# Altium project diplomka_hiearchical.PrjPcb (part 3 of 4)
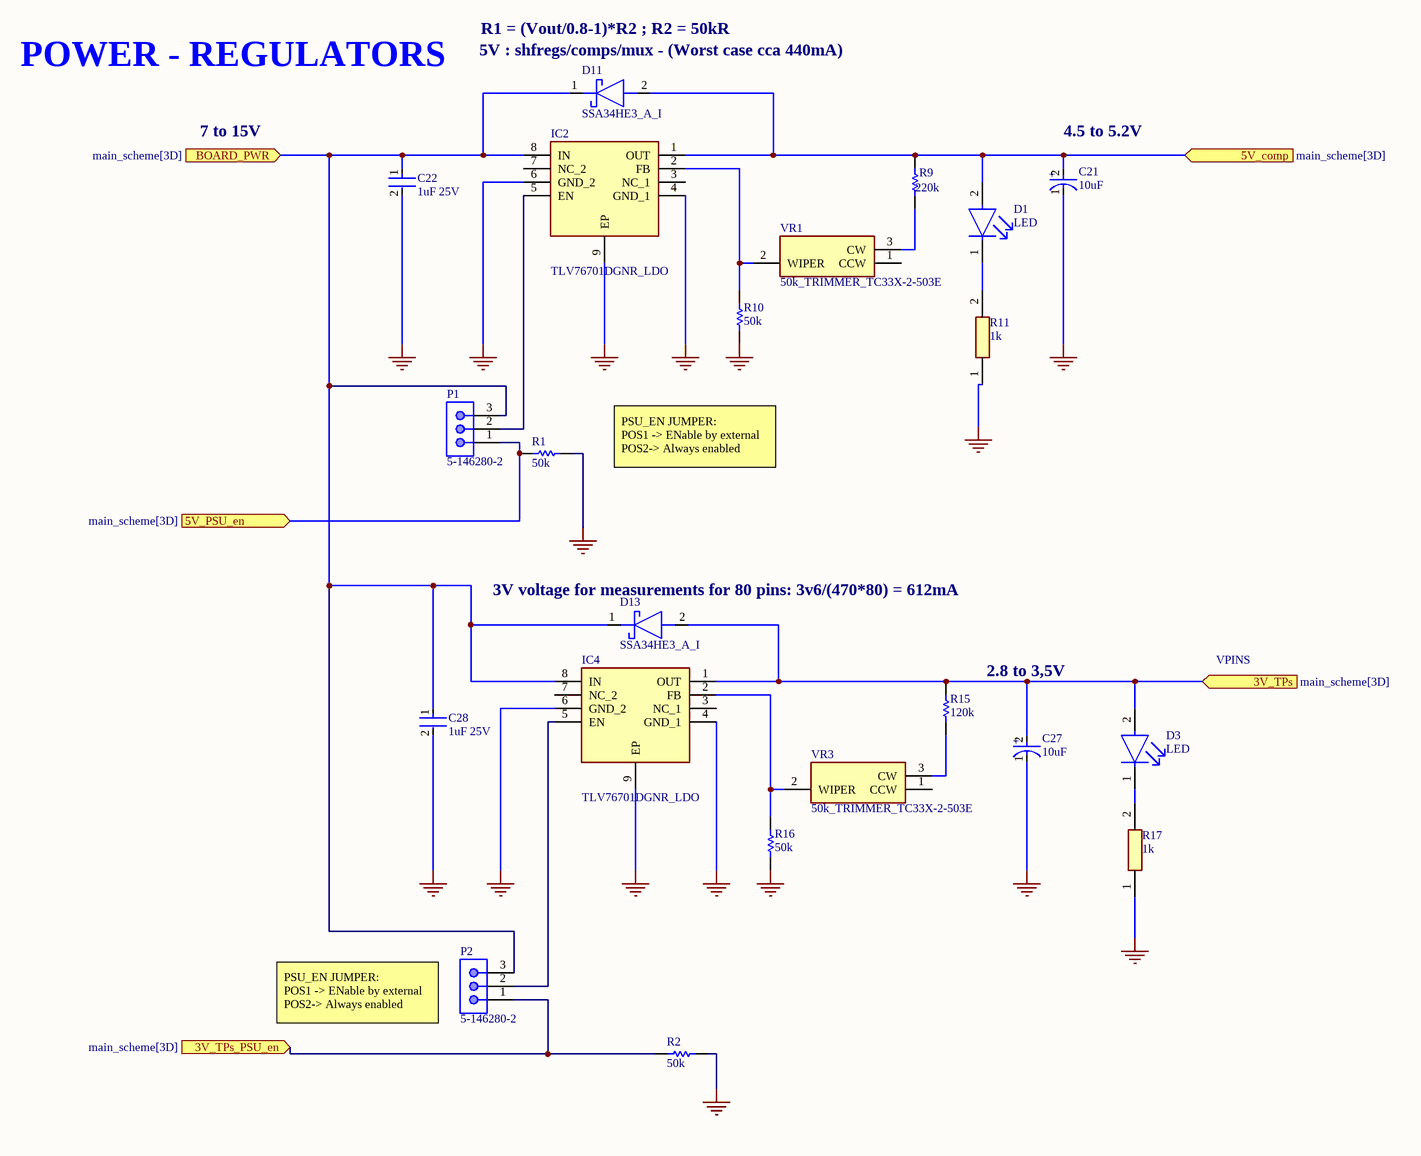
[diagram p5: POWER.SchDoc]
## Nets that join several sheets
BOARD_PWR: main_scheme (6 pins), POWER (8 pins)
GND: main_scheme (7 pins), U_ALL_channels/8pins1 (6 pins), U_ALL_channels/8pins1/dTP (U_ALL_channels_8pins1_dTP_IC1#1.4 U_ALL_channels_8pins1_dTP_Q3#1.2 U_ALL_channels_8pins1_dTP_Q4#1.2), U_ALL_channels/8pins1/dTP (U_ALL_channels_8pins1_dTP_IC1#2.4 U_ALL_channels_8pins1_dTP_Q3#2.2 U_ALL_channels_8pins1_dTP_Q4#2.2), U_ALL_channels/8pins1/dTP (U_ALL_channels_8pins1_dTP_IC1#3.4 U_ALL_channels_8pins1_dTP_Q3#3.2 U_ALL_channels_8pins1_dTP_Q4#3.2), U_ALL_channels/8pins1/dTP (U_ALL_channels_8pins1_dTP_IC1#4.4 U_ALL_channels_8pins1_dTP_Q3#4.2 U_ALL_channels_8pins1_dTP_Q4#4.2), U_ALL_channels/8pins2 (6 pins), U_ALL_channels/8pins2/dTP (U_ALL_channels_8pins2_dTP_IC1#1.4 U_ALL_channels_8pins2_dTP_Q3#1.2 U_ALL_channels_8pins2_dTP_Q4#1.2), U_ALL_channels/8pins2/dTP (U_ALL_channels_8pins2_dTP_IC1#2.4 U_ALL_channels_8pins2_dTP_Q3#2.2 U_ALL_channels_8pins2_dTP_Q4#2.2), U_ALL_channels/8pins2/dTP (U_ALL_channels_8pins2_dTP_IC1#3.4 U_ALL_channels_8pins2_dTP_Q3#3.2 U_ALL_channels_8pins2_dTP_Q4#3.2), U_ALL_channels/8pins2/dTP (U_ALL_channels_8pins2_dTP_IC1#4.4 U_ALL_channels_8pins2_dTP_Q3#4.2 U_ALL_channels_8pins2_dTP_Q4#4.2), U_ALL_channels/8pins3 (6 pins), U_ALL_channels/8pins3/dTP (U_ALL_channels_8pins3_dTP_IC1#1.4 U_ALL_channels_8pins3_dTP_Q3#1.2 U_ALL_channels_8pins3_dTP_Q4#1.2), U_ALL_channels/8pins3/dTP (U_ALL_channels_8pins3_dTP_IC1#2.4 U_ALL_channels_8pins3_dTP_Q3#2.2 U_ALL_channels_8pins3_dTP_Q4#2.2), U_ALL_channels/8pins3/dTP (U_ALL_channels_8pins3_dTP_IC1#3.4 U_ALL_channels_8pins3_dTP_Q3#3.2 U_ALL_channels_8pins3_dTP_Q4#3.2), U_ALL_channels/8pins3/dTP (U_ALL_channels_8pins3_dTP_IC1#4.4 U_ALL_channels_8pins3_dTP_Q3#4.2 U_ALL_channels_8pins3_dTP_Q4#4.2), U_ALL_channels/8pins4 (6 pins), U_ALL_channels/8pins4/dTP (U_ALL_channels_8pins4_dTP_IC1#1.4 U_ALL_channels_8pins4_dTP_Q3#1.2 U_ALL_channels_8pins4_dTP_Q4#1.2), U_ALL_channels/8pins4/dTP (U_ALL_channels_8pins4_dTP_IC1#2.4 U_ALL_channels_8pins4_dTP_Q3#2.2 U_ALL_channels_8pins4_dTP_Q4#2.2), U_ALL_channels/8pins4/dTP (U_ALL_channels_8pins4_dTP_IC1#3.4 U_ALL_channels_8pins4_dTP_Q3#3.2 U_ALL_channels_8pins4_dTP_Q4#3.2), U_ALL_channels/8pins4/dTP (U_ALL_channels_8pins4_dTP_IC1#4.4 U_ALL_channels_8pins4_dTP_Q3#4.2 U_ALL_channels_8pins4_dTP_Q4#4.2), U_ALL_channels/8pins5 (6 pins), U_ALL_channels/8pins5/dTP (U_ALL_channels_8pins5_dTP_IC1#1.4 U_ALL_channels_8pins5_dTP_Q3#1.2 U_ALL_channels_8pins5_dTP_Q4#1.2), U_ALL_channels/8pins5/dTP (U_ALL_channels_8pins5_dTP_IC1#2.4 U_ALL_channels_8pins5_dTP_Q3#2.2 U_ALL_channels_8pins5_dTP_Q4#2.2), U_ALL_channels/8pins5/dTP (U_ALL_channels_8pins5_dTP_IC1#3.4 U_ALL_channels_8pins5_dTP_Q3#3.2 U_ALL_channels_8pins5_dTP_Q4#3.2), U_ALL_channels/8pins5/dTP (U_ALL_channels_8pins5_dTP_IC1#4.4 U_ALL_channels_8pins5_dTP_Q3#4.2 U_ALL_channels_8pins5_dTP_Q4#4.2), U_ALL_channels/8pins6 (6 pins), U_ALL_channels/8pins6/dTP (U_ALL_channels_8pins6_dTP_IC1#1.4 U_ALL_channels_8pins6_dTP_Q3#1.2 U_ALL_channels_8pins6_dTP_Q4#1.2), U_ALL_channels/8pins6/dTP (U_ALL_channels_8pins6_dTP_IC1#2.4 U_ALL_channels_8pins6_dTP_Q3#2.2 U_ALL_channels_8pins6_dTP_Q4#2.2), U_ALL_channels/8pins6/dTP (U_ALL_channels_8pins6_dTP_IC1#3.4 U_ALL_channels_8pins6_dTP_Q3#3.2 U_ALL_channels_8pins6_dTP_Q4#3.2), U_ALL_channels/8pins6/dTP (U_ALL_channels_8pins6_dTP_IC1#4.4 U_ALL_channels_8pins6_dTP_Q3#4.2 U_ALL_channels_8pins6_dTP_Q4#4.2), U_ALL_channels/8pins7 (6 pins), U_ALL_channels/8pins7/dTP (U_ALL_channels_8pins7_dTP_IC1#1.4 U_ALL_channels_8pins7_dTP_Q3#1.2 U_ALL_channels_8pins7_dTP_Q4#1.2), U_ALL_channels/8pins7/dTP (U_ALL_channels_8pins7_dTP_IC1#2.4 U_ALL_channels_8pins7_dTP_Q3#2.2 U_ALL_channels_8pins7_dTP_Q4#2.2), U_ALL_channels/8pins7/dTP (U_ALL_channels_8pins7_dTP_IC1#3.4 U_ALL_channels_8pins7_dTP_Q3#3.2 U_ALL_channels_8pins7_dTP_Q4#3.2), U_ALL_channels/8pins7/dTP (U_ALL_channels_8pins7_dTP_IC1#4.4 U_ALL_channels_8pins7_dTP_Q3#4.2 U_ALL_channels_8pins7_dTP_Q4#4.2), U_ALL_channels/8pins8 (6 pins), U_ALL_channels/8pins8/dTP (U_ALL_channels_8pins8_dTP_IC1#1.4 U_ALL_channels_8pins8_dTP_Q3#1.2 U_ALL_channels_8pins8_dTP_Q4#1.2), U_ALL_channels/8pins8/dTP (U_ALL_channels_8pins8_dTP_IC1#2.4 U_ALL_channels_8pins8_dTP_Q3#2.2 U_ALL_channels_8pins8_dTP_Q4#2.2), U_ALL_channels/8pins8/dTP (U_ALL_channels_8pins8_dTP_IC1#3.4 U_ALL_channels_8pins8_dTP_Q3#3.2 U_ALL_channels_8pins8_dTP_Q4#3.2), U_ALL_channels/8pins8/dTP (U_ALL_channels_8pins8_dTP_IC1#4.4 U_ALL_channels_8pins8_dTP_Q3#4.2 U_ALL_channels_8pins8_dTP_Q4#4.2), U_ALL_channels/8pins9 (6 pins), U_ALL_channels/8pins9/dTP (U_ALL_channels_8pins9_dTP_IC1#1.4 U_ALL_channels_8pins9_dTP_Q3#1.2 U_ALL_channels_8pins9_dTP_Q4#1.2), U_ALL_channels/8pins9/dTP (U_ALL_channels_8pins9_dTP_IC1#2.4 U_ALL_channels_8pins9_dTP_Q3#2.2 U_ALL_channels_8pins9_dTP_Q4#2.2), U_ALL_channels/8pins9/dTP (U_ALL_channels_8pins9_dTP_IC1#3.4 U_ALL_channels_8pins9_dTP_Q3#3.2 U_ALL_channels_8pins9_dTP_Q4#3.2), U_ALL_channels/8pins9/dTP (U_ALL_channels_8pins9_dTP_IC1#4.4 U_ALL_channels_8pins9_dTP_Q3#4.2 U_ALL_channels_8pins9_dTP_Q4#4.2), U_ALL_channels/8pins10 (6 pins), U_ALL_channels/8pins10/dTP (U_ALL_channels_8pins10_dTP_IC1#1.4 U_ALL_channels_8pins10_dTP_Q3#1.2 U_ALL_channels_8pins10_dTP_Q4#1.2), U_ALL_channels/8pins10/dTP (U_ALL_channels_8pins10_dTP_IC1#2.4 U_ALL_channels_8pins10_dTP_Q3#2.2 U_ALL_channels_8pins10_dTP_Q4#2.2), U_ALL_channels/8pins10/dTP (U_ALL_channels_8pins10_dTP_IC1#3.4 U_ALL_channels_8pins10_dTP_Q3#3.2 U_ALL_channels_8pins10_dTP_Q4#3.2), U_ALL_channels/8pins10/dTP (U_ALL_channels_8pins10_dTP_IC1#4.4 U_ALL_channels_8pins10_dTP_Q3#4.2 U_ALL_channels_8pins10_dTP_Q4#4.2), POWER (16 pins)
PWR_MCU: main_scheme (J1.A28 J1.B28 J1.C28 J22.28), U_ALL_channels/8pins1/dTP (U_ALL_channels_8pins1_dTP_R5#1.1 U_ALL_channels_8pins1_dTP_R6#1.1), U_ALL_channels/8pins1/dTP (U_ALL_channels_8pins1_dTP_R5#2.1 U_ALL_channels_8pins1_dTP_R6#2.1), U_ALL_channels/8pins1/dTP (U_ALL_channels_8pins1_dTP_R5#3.1 U_ALL_channels_8pins1_dTP_R6#3.1), U_ALL_channels/8pins1/dTP (U_ALL_channels_8pins1_dTP_R5#4.1 U_ALL_channels_8pins1_dTP_R6#4.1), U_ALL_channels/8pins2/dTP (U_ALL_channels_8pins2_dTP_R5#1.1 U_ALL_channels_8pins2_dTP_R6#1.1), U_ALL_channels/8pins2/dTP (U_ALL_channels_8pins2_dTP_R5#2.1 U_ALL_channels_8pins2_dTP_R6#2.1), U_ALL_channels/8pins2/dTP (U_ALL_channels_8pins2_dTP_R5#3.1 U_ALL_channels_8pins2_dTP_R6#3.1), U_ALL_channels/8pins2/dTP (U_ALL_channels_8pins2_dTP_R5#4.1 U_ALL_channels_8pins2_dTP_R6#4.1), U_ALL_channels/8pins3/dTP (U_ALL_channels_8pins3_dTP_R5#1.1 U_ALL_channels_8pins3_dTP_R6#1.1), U_ALL_channels/8pins3/dTP (U_ALL_channels_8pins3_dTP_R5#2.1 U_ALL_channels_8pins3_dTP_R6#2.1), U_ALL_channels/8pins3/dTP (U_ALL_channels_8pins3_dTP_R5#3.1 U_ALL_channels_8pins3_dTP_R6#3.1), U_ALL_channels/8pins3/dTP (U_ALL_channels_8pins3_dTP_R5#4.1 U_ALL_channels_8pins3_dTP_R6#4.1), U_ALL_channels/8pins4/dTP (U_ALL_channels_8pins4_dTP_R5#1.1 U_ALL_channels_8pins4_dTP_R6#1.1), U_ALL_channels/8pins4/dTP (U_ALL_channels_8pins4_dTP_R5#2.1 U_ALL_channels_8pins4_dTP_R6#2.1), U_ALL_channels/8pins4/dTP (U_ALL_channels_8pins4_dTP_R5#3.1 U_ALL_channels_8pins4_dTP_R6#3.1), U_ALL_channels/8pins4/dTP (U_ALL_channels_8pins4_dTP_R5#4.1 U_ALL_channels_8pins4_dTP_R6#4.1), U_ALL_channels/8pins5/dTP (U_ALL_channels_8pins5_dTP_R5#1.1 U_ALL_channels_8pins5_dTP_R6#1.1), U_ALL_channels/8pins5/dTP (U_ALL_channels_8pins5_dTP_R5#2.1 U_ALL_channels_8pins5_dTP_R6#2.1), U_ALL_channels/8pins5/dTP (U_ALL_channels_8pins5_dTP_R5#3.1 U_ALL_channels_8pins5_dTP_R6#3.1), U_ALL_channels/8pins5/dTP (U_ALL_channels_8pins5_dTP_R5#4.1 U_ALL_channels_8pins5_dTP_R6#4.1), U_ALL_channels/8pins6/dTP (U_ALL_channels_8pins6_dTP_R5#1.1 U_ALL_channels_8pins6_dTP_R6#1.1), U_ALL_channels/8pins6/dTP (U_ALL_channels_8pins6_dTP_R5#2.1 U_ALL_channels_8pins6_dTP_R6#2.1), U_ALL_channels/8pins6/dTP (U_ALL_channels_8pins6_dTP_R5#3.1 U_ALL_channels_8pins6_dTP_R6#3.1), U_ALL_channels/8pins6/dTP (U_ALL_channels_8pins6_dTP_R5#4.1 U_ALL_channels_8pins6_dTP_R6#4.1), U_ALL_channels/8pins7/dTP (U_ALL_channels_8pins7_dTP_R5#1.1 U_ALL_channels_8pins7_dTP_R6#1.1), U_ALL_channels/8pins7/dTP (U_ALL_channels_8pins7_dTP_R5#2.1 U_ALL_channels_8pins7_dTP_R6#2.1), U_ALL_channels/8pins7/dTP (U_ALL_channels_8pins7_dTP_R5#3.1 U_ALL_channels_8pins7_dTP_R6#3.1), U_ALL_channels/8pins7/dTP (U_ALL_channels_8pins7_dTP_R5#4.1 U_ALL_channels_8pins7_dTP_R6#4.1), U_ALL_channels/8pins8/dTP (U_ALL_channels_8pins8_dTP_R5#1.1 U_ALL_channels_8pins8_dTP_R6#1.1), U_ALL_channels/8pins8/dTP (U_ALL_channels_8pins8_dTP_R5#2.1 U_ALL_channels_8pins8_dTP_R6#2.1), U_ALL_channels/8pins8/dTP (U_ALL_channels_8pins8_dTP_R5#3.1 U_ALL_channels_8pins8_dTP_R6#3.1), U_ALL_channels/8pins8/dTP (U_ALL_channels_8pins8_dTP_R5#4.1 U_ALL_channels_8pins8_dTP_R6#4.1), U_ALL_channels/8pins9/dTP (U_ALL_channels_8pins9_dTP_R5#1.1 U_ALL_channels_8pins9_dTP_R6#1.1), U_ALL_channels/8pins9/dTP (U_ALL_channels_8pins9_dTP_R5#2.1 U_ALL_channels_8pins9_dTP_R6#2.1), U_ALL_channels/8pins9/dTP (U_ALL_channels_8pins9_dTP_R5#3.1 U_ALL_channels_8pins9_dTP_R6#3.1), U_ALL_channels/8pins9/dTP (U_ALL_channels_8pins9_dTP_R5#4.1 U_ALL_channels_8pins9_dTP_R6#4.1), U_ALL_channels/8pins10/dTP (U_ALL_channels_8pins10_dTP_R5#1.1 U_ALL_channels_8pins10_dTP_R6#1.1), U_ALL_channels/8pins10/dTP (U_ALL_channels_8pins10_dTP_R5#2.1 U_ALL_channels_8pins10_dTP_R6#2.1), U_ALL_channels/8pins10/dTP (U_ALL_channels_8pins10_dTP_R5#3.1 U_ALL_channels_8pins10_dTP_R6#3.1), U_ALL_channels/8pins10/dTP (U_ALL_channels_8pins10_dTP_R5#4.1 U_ALL_channels_8pins10_dTP_R6#4.1)
Vpins: main_scheme (J1.A30 J1.B30 J1.C30 J22.30), U_ALL_channels/8pins1/dTP (U_ALL_channels_8pins1_dTP_Q1#1.2 U_ALL_channels_8pins1_dTP_Q2#1.2), U_ALL_channels/8pins1/dTP (U_ALL_channels_8pins1_dTP_Q1#2.2 U_ALL_channels_8pins1_dTP_Q2#2.2), U_ALL_channels/8pins1/dTP (U_ALL_channels_8pins1_dTP_Q1#3.2 U_ALL_channels_8pins1_dTP_Q2#3.2), U_ALL_channels/8pins1/dTP (U_ALL_channels_8pins1_dTP_Q1#4.2 U_ALL_channels_8pins1_dTP_Q2#4.2), U_ALL_channels/8pins2/dTP (U_ALL_channels_8pins2_dTP_Q1#1.2 U_ALL_channels_8pins2_dTP_Q2#1.2), U_ALL_channels/8pins2/dTP (U_ALL_channels_8pins2_dTP_Q1#2.2 U_ALL_channels_8pins2_dTP_Q2#2.2), U_ALL_channels/8pins2/dTP (U_ALL_channels_8pins2_dTP_Q1#3.2 U_ALL_channels_8pins2_dTP_Q2#3.2), U_ALL_channels/8pins2/dTP (U_ALL_channels_8pins2_dTP_Q1#4.2 U_ALL_channels_8pins2_dTP_Q2#4.2), U_ALL_channels/8pins3/dTP (U_ALL_channels_8pins3_dTP_Q1#1.2 U_ALL_channels_8pins3_dTP_Q2#1.2), U_ALL_channels/8pins3/dTP (U_ALL_channels_8pins3_dTP_Q1#2.2 U_ALL_channels_8pins3_dTP_Q2#2.2), U_ALL_channels/8pins3/dTP (U_ALL_channels_8pins3_dTP_Q1#3.2 U_ALL_channels_8pins3_dTP_Q2#3.2), U_ALL_channels/8pins3/dTP (U_ALL_channels_8pins3_dTP_Q1#4.2 U_ALL_channels_8pins3_dTP_Q2#4.2), U_ALL_channels/8pins4/dTP (U_ALL_channels_8pins4_dTP_Q1#1.2 U_ALL_channels_8pins4_dTP_Q2#1.2), U_ALL_channels/8pins4/dTP (U_ALL_channels_8pins4_dTP_Q1#2.2 U_ALL_channels_8pins4_dTP_Q2#2.2), U_ALL_channels/8pins4/dTP (U_ALL_channels_8pins4_dTP_Q1#3.2 U_ALL_channels_8pins4_dTP_Q2#3.2), U_ALL_channels/8pins4/dTP (U_ALL_channels_8pins4_dTP_Q1#4.2 U_ALL_channels_8pins4_dTP_Q2#4.2), U_ALL_channels/8pins5/dTP (U_ALL_channels_8pins5_dTP_Q1#1.2 U_ALL_channels_8pins5_dTP_Q2#1.2), U_ALL_channels/8pins5/dTP (U_ALL_channels_8pins5_dTP_Q1#2.2 U_ALL_channels_8pins5_dTP_Q2#2.2), U_ALL_channels/8pins5/dTP (U_ALL_channels_8pins5_dTP_Q1#3.2 U_ALL_channels_8pins5_dTP_Q2#3.2), U_ALL_channels/8pins5/dTP (U_ALL_channels_8pins5_dTP_Q1#4.2 U_ALL_channels_8pins5_dTP_Q2#4.2), U_ALL_channels/8pins6/dTP (U_ALL_channels_8pins6_dTP_Q1#1.2 U_ALL_channels_8pins6_dTP_Q2#1.2), U_ALL_channels/8pins6/dTP (U_ALL_channels_8pins6_dTP_Q1#2.2 U_ALL_channels_8pins6_dTP_Q2#2.2), U_ALL_channels/8pins6/dTP (U_ALL_channels_8pins6_dTP_Q1#3.2 U_ALL_channels_8pins6_dTP_Q2#3.2), U_ALL_channels/8pins6/dTP (U_ALL_channels_8pins6_dTP_Q1#4.2 U_ALL_channels_8pins6_dTP_Q2#4.2), U_ALL_channels/8pins7/dTP (U_ALL_channels_8pins7_dTP_Q1#1.2 U_ALL_channels_8pins7_dTP_Q2#1.2), U_ALL_channels/8pins7/dTP (U_ALL_channels_8pins7_dTP_Q1#2.2 U_ALL_channels_8pins7_dTP_Q2#2.2), U_ALL_channels/8pins7/dTP (U_ALL_channels_8pins7_dTP_Q1#3.2 U_ALL_channels_8pins7_dTP_Q2#3.2), U_ALL_channels/8pins7/dTP (U_ALL_channels_8pins7_dTP_Q1#4.2 U_ALL_channels_8pins7_dTP_Q2#4.2), U_ALL_channels/8pins8/dTP (U_ALL_channels_8pins8_dTP_Q1#1.2 U_ALL_channels_8pins8_dTP_Q2#1.2), U_ALL_channels/8pins8/dTP (U_ALL_channels_8pins8_dTP_Q1#2.2 U_ALL_channels_8pins8_dTP_Q2#2.2), U_ALL_channels/8pins8/dTP (U_ALL_channels_8pins8_dTP_Q1#3.2 U_ALL_channels_8pins8_dTP_Q2#3.2), U_ALL_channels/8pins8/dTP (U_ALL_channels_8pins8_dTP_Q1#4.2 U_ALL_channels_8pins8_dTP_Q2#4.2), U_ALL_channels/8pins9/dTP (U_ALL_channels_8pins9_dTP_Q1#1.2 U_ALL_channels_8pins9_dTP_Q2#1.2), U_ALL_channels/8pins9/dTP (U_ALL_channels_8pins9_dTP_Q1#2.2 U_ALL_channels_8pins9_dTP_Q2#2.2), U_ALL_channels/8pins9/dTP (U_ALL_channels_8pins9_dTP_Q1#3.2 U_ALL_channels_8pins9_dTP_Q2#3.2), U_ALL_channels/8pins9/dTP (U_ALL_channels_8pins9_dTP_Q1#4.2 U_ALL_channels_8pins9_dTP_Q2#4.2), U_ALL_channels/8pins10/dTP (U_ALL_channels_8pins10_dTP_Q1#1.2 U_ALL_channels_8pins10_dTP_Q2#1.2), U_ALL_channels/8pins10/dTP (U_ALL_channels_8pins10_dTP_Q1#2.2 U_ALL_channels_8pins10_dTP_Q2#2.2), U_ALL_channels/8pins10/dTP (U_ALL_channels_8pins10_dTP_Q1#3.2 U_ALL_channels_8pins10_dTP_Q2#3.2), U_ALL_channels/8pins10/dTP (U_ALL_channels_8pins10_dTP_Q1#4.2 U_ALL_channels_8pins10_dTP_Q2#4.2), POWER (5 pins)
Vref: main_scheme (J1.C27 J22.32), U_ALL_channels/8pins1/dTP (U_ALL_channels_8pins1_dTP_IC1#1.2 U_ALL_channels_8pins1_dTP_IC1#1.6), U_ALL_channels/8pins1/dTP (U_ALL_channels_8pins1_dTP_IC1#2.2 U_ALL_channels_8pins1_dTP_IC1#2.6), U_ALL_channels/8pins1/dTP (U_ALL_channels_8pins1_dTP_IC1#3.2 U_ALL_channels_8pins1_dTP_IC1#3.6), U_ALL_channels/8pins1/dTP (U_ALL_channels_8pins1_dTP_IC1#4.2 U_ALL_channels_8pins1_dTP_IC1#4.6), U_ALL_channels/8pins2/dTP (U_ALL_channels_8pins2_dTP_IC1#1.2 U_ALL_channels_8pins2_dTP_IC1#1.6), U_ALL_channels/8pins2/dTP (U_ALL_channels_8pins2_dTP_IC1#2.2 U_ALL_channels_8pins2_dTP_IC1#2.6), U_ALL_channels/8pins2/dTP (U_ALL_channels_8pins2_dTP_IC1#3.2 U_ALL_channels_8pins2_dTP_IC1#3.6), U_ALL_channels/8pins2/dTP (U_ALL_channels_8pins2_dTP_IC1#4.2 U_ALL_channels_8pins2_dTP_IC1#4.6), U_ALL_channels/8pins3/dTP (U_ALL_channels_8pins3_dTP_IC1#1.2 U_ALL_channels_8pins3_dTP_IC1#1.6), U_ALL_channels/8pins3/dTP (U_ALL_channels_8pins3_dTP_IC1#2.2 U_ALL_channels_8pins3_dTP_IC1#2.6), U_ALL_channels/8pins3/dTP (U_ALL_channels_8pins3_dTP_IC1#3.2 U_ALL_channels_8pins3_dTP_IC1#3.6), U_ALL_channels/8pins3/dTP (U_ALL_channels_8pins3_dTP_IC1#4.2 U_ALL_channels_8pins3_dTP_IC1#4.6), U_ALL_channels/8pins4/dTP (U_ALL_channels_8pins4_dTP_IC1#1.2 U_ALL_channels_8pins4_dTP_IC1#1.6), U_ALL_channels/8pins4/dTP (U_ALL_channels_8pins4_dTP_IC1#2.2 U_ALL_channels_8pins4_dTP_IC1#2.6), U_ALL_channels/8pins4/dTP (U_ALL_channels_8pins4_dTP_IC1#3.2 U_ALL_channels_8pins4_dTP_IC1#3.6), U_ALL_channels/8pins4/dTP (U_ALL_channels_8pins4_dTP_IC1#4.2 U_ALL_channels_8pins4_dTP_IC1#4.6), U_ALL_channels/8pins5/dTP (U_ALL_channels_8pins5_dTP_IC1#1.2 U_ALL_channels_8pins5_dTP_IC1#1.6), U_ALL_channels/8pins5/dTP (U_ALL_channels_8pins5_dTP_IC1#2.2 U_ALL_channels_8pins5_dTP_IC1#2.6), U_ALL_channels/8pins5/dTP (U_ALL_channels_8pins5_dTP_IC1#3.2 U_ALL_channels_8pins5_dTP_IC1#3.6), U_ALL_channels/8pins5/dTP (U_ALL_channels_8pins5_dTP_IC1#4.2 U_ALL_channels_8pins5_dTP_IC1#4.6), U_ALL_channels/8pins6/dTP (U_ALL_channels_8pins6_dTP_IC1#1.2 U_ALL_channels_8pins6_dTP_IC1#1.6), U_ALL_channels/8pins6/dTP (U_ALL_channels_8pins6_dTP_IC1#2.2 U_ALL_channels_8pins6_dTP_IC1#2.6), U_ALL_channels/8pins6/dTP (U_ALL_channels_8pins6_dTP_IC1#3.2 U_ALL_channels_8pins6_dTP_IC1#3.6), U_ALL_channels/8pins6/dTP (U_ALL_channels_8pins6_dTP_IC1#4.2 U_ALL_channels_8pins6_dTP_IC1#4.6), U_ALL_channels/8pins7/dTP (U_ALL_channels_8pins7_dTP_IC1#1.2 U_ALL_channels_8pins7_dTP_IC1#1.6), U_ALL_channels/8pins7/dTP (U_ALL_channels_8pins7_dTP_IC1#2.2 U_ALL_channels_8pins7_dTP_IC1#2.6), U_ALL_channels/8pins7/dTP (U_ALL_channels_8pins7_dTP_IC1#3.2 U_ALL_channels_8pins7_dTP_IC1#3.6), U_ALL_channels/8pins7/dTP (U_ALL_channels_8pins7_dTP_IC1#4.2 U_ALL_channels_8pins7_dTP_IC1#4.6), U_ALL_channels/8pins8/dTP (U_ALL_channels_8pins8_dTP_IC1#1.2 U_ALL_channels_8pins8_dTP_IC1#1.6), U_ALL_channels/8pins8/dTP (U_ALL_channels_8pins8_dTP_IC1#2.2 U_ALL_channels_8pins8_dTP_IC1#2.6), U_ALL_channels/8pins8/dTP (U_ALL_channels_8pins8_dTP_IC1#3.2 U_ALL_channels_8pins8_dTP_IC1#3.6), U_ALL_channels/8pins8/dTP (U_ALL_channels_8pins8_dTP_IC1#4.2 U_ALL_channels_8pins8_dTP_IC1#4.6), U_ALL_channels/8pins9/dTP (U_ALL_channels_8pins9_dTP_IC1#1.2 U_ALL_channels_8pins9_dTP_IC1#1.6), U_ALL_channels/8pins9/dTP (U_ALL_channels_8pins9_dTP_IC1#2.2 U_ALL_channels_8pins9_dTP_IC1#2.6), U_ALL_channels/8pins9/dTP (U_ALL_channels_8pins9_dTP_IC1#3.2 U_ALL_channels_8pins9_dTP_IC1#3.6), U_ALL_channels/8pins9/dTP (U_ALL_channels_8pins9_dTP_IC1#4.2 U_ALL_channels_8pins9_dTP_IC1#4.6), U_ALL_channels/8pins10/dTP (U_ALL_channels_8pins10_dTP_IC1#1.2 U_ALL_channels_8pins10_dTP_IC1#1.6), U_ALL_channels/8pins10/dTP (U_ALL_channels_8pins10_dTP_IC1#2.2 U_ALL_channels_8pins10_dTP_IC1#2.6), U_ALL_channels/8pins10/dTP (U_ALL_channels_8pins10_dTP_IC1#3.2 U_ALL_channels_8pins10_dTP_IC1#3.6), U_ALL_channels/8pins10/dTP (U_ALL_channels_8pins10_dTP_IC1#4.2 U_ALL_channels_8pins10_dTP_IC1#4.6)
3V_en: main_scheme (J22.20), POWER (P2.1 R2.2)
5V_en: main_scheme (J22.18), POWER (P1.1 R1.2)
MUX_D_1: main_scheme (J22.31), U_ALL_channels/8pins1 (8pins1_U3.3)
MUX_D_2: main_scheme (J22.29), U_ALL_channels/8pins2 (8pins2_U3.3)
MUX_D_3: main_scheme (J22.27), U_ALL_channels/8pins3 (8pins3_U3.3)
MUX_D_4: main_scheme (J22.25), U_ALL_channels/8pins4 (8pins4_U3.3)
MUX_D_5: main_scheme (J22.23), U_ALL_channels/8pins5 (8pins5_U3.3)
MUX_D_6: main_scheme (J22.1), U_ALL_channels/8pins6 (8pins6_U3.3)
MUX_D_7: main_scheme (J22.2), U_ALL_channels/8pins7 (8pins7_U3.3)
MUX_D_8: main_scheme (J22.4), U_ALL_channels/8pins8 (8pins8_U3.3)
MUX_D_9: main_scheme (J22.6), U_ALL_channels/8pins9 (8pins9_U3.3)
MUX_D_10: main_scheme (J22.8), U_ALL_channels/8pins10 (8pins10_U3.3)
MUXes_1to5__A0: main_scheme (J22.33), U_ALL_channels/8pins1 (8pins1_U3.11), U_ALL_channels/8pins2 (8pins2_U3.11), U_ALL_channels/8pins3 (8pins3_U3.11), U_ALL_channels/8pins4 (8pins4_U3.11), U_ALL_channels/8pins5 (8pins5_U3.11)
MUXes_1to5__A1: main_scheme (J22.37), U_ALL_channels/8pins1 (8pins1_U3.10), U_ALL_channels/8pins2 (8pins2_U3.10), U_ALL_channels/8pins3 (8pins3_U3.10), U_ALL_channels/8pins4 (8pins4_U3.10), U_ALL_channels/8pins5 (8pins5_U3.10)
MUXes_1to5__A2: main_scheme (J22.39), U_ALL_channels/8pins1 (8pins1_U3.9), U_ALL_channels/8pins2 (8pins2_U3.9), U_ALL_channels/8pins3 (8pins3_U3.9), U_ALL_channels/8pins4 (8pins4_U3.9), U_ALL_channels/8pins5 (8pins5_U3.9)
MUXes_1to5_nEN: main_scheme (J22.35), U_ALL_channels/8pins1 (8pins1_U3.6), U_ALL_channels/8pins2 (8pins2_U3.6), U_ALL_channels/8pins3 (8pins3_U3.6), U_ALL_channels/8pins4 (8pins4_U3.6), U_ALL_channels/8pins5 (8pins5_U3.6)
MUXes_6TO10_A0: main_scheme (J22.12), U_ALL_channels/8pins6 (8pins6_U3.11), U_ALL_channels/8pins7 (8pins7_U3.11), U_ALL_channels/8pins8 (8pins8_U3.11), U_ALL_channels/8pins9 (8pins9_U3.11), U_ALL_channels/8pins10 (8pins10_U3.11)
MUXes_6TO10_A1: main_scheme (J22.16), U_ALL_channels/8pins6 (8pins6_U3.9), U_ALL_channels/8pins7 (8pins7_U3.9), U_ALL_channels/8pins8 (8pins8_U3.9), U_ALL_channels/8pins9 (8pins9_U3.9), U_ALL_channels/8pins10 (8pins10_U3.9)
MUXes_6TO10_A2: main_scheme (J22.14), U_ALL_channels/8pins6 (8pins6_U3.10), U_ALL_channels/8pins7 (8pins7_U3.10), U_ALL_channels/8pins8 (8pins8_U3.10), U_ALL_channels/8pins9 (8pins9_U3.10), U_ALL_channels/8pins10 (8pins10_U3.10)
MUXes_6TO10_nEN: main_scheme (J22.10), U_ALL_channels/8pins6 (8pins6_U3.6), U_ALL_channels/8pins7 (8pins7_U3.6), U_ALL_channels/8pins8 (8pins8_U3.6), U_ALL_channels/8pins9 (8pins9_U3.6), U_ALL_channels/8pins10 (8pins10_U3.6)
Net8pins1_U2_1: U_ALL_channels/8pins1 (8pins1_U2.1), U_ALL_channels/8pins1/dTP (U_ALL_channels_8pins1_dTP_Q4#4.1)
Net8pins1_U2_2: U_ALL_channels/8pins1 (8pins1_U2.2), U_ALL_channels/8pins1/dTP (U_ALL_channels_8pins1_dTP_Q3#3.1)
Net8pins1_U2_3: U_ALL_channels/8pins1 (8pins1_U2.3), U_ALL_channels/8pins1/dTP (U_ALL_channels_8pins1_dTP_Q4#3.1)
Net8pins1_U2_4: U_ALL_channels/8pins1 (8pins1_U2.4), U_ALL_channels/8pins1/dTP (U_ALL_channels_8pins1_dTP_Q3#2.1)
Net8pins1_U2_5: U_ALL_channels/8pins1 (8pins1_U2.5), U_ALL_channels/8pins1/dTP (U_ALL_channels_8pins1_dTP_Q4#2.1)
Net8pins1_U2_6: U_ALL_channels/8pins1 (8pins1_U2.6), U_ALL_channels/8pins1/dTP (U_ALL_channels_8pins1_dTP_Q3#1.1)
Net8pins1_U2_7: U_ALL_channels/8pins1 (8pins1_U2.7), U_ALL_channels/8pins1/dTP (U_ALL_channels_8pins1_dTP_Q4#1.1)
Net8pins1_U2_9: U_ALL_channels/8pins1 (8pins1_U2.9), U_ALL_channels/8pins2 (8pins2_U2.14)
Net8pins1_U2_15: U_ALL_channels/8pins1 (8pins1_U2.15), U_ALL_channels/8pins1/dTP (U_ALL_channels_8pins1_dTP_Q3#4.1)
Net8pins1_U3_1: U_ALL_channels/8pins1 (8pins1_U3.1), U_ALL_channels/8pins1/dTP (U_ALL_channels_8pins1_dTP_IC1#2.1 U_ALL_channels_8pins1_dTP_R5#2.2)
Net8pins1_U3_2: U_ALL_channels/8pins1 (8pins1_U3.2), U_ALL_channels/8pins1/dTP (U_ALL_channels_8pins1_dTP_IC1#1.1 U_ALL_channels_8pins1_dTP_R5#1.2)
Net8pins1_U3_4: U_ALL_channels/8pins1 (8pins1_U3.4), U_ALL_channels/8pins1/dTP (U_ALL_channels_8pins1_dTP_IC1#1.7 U_ALL_channels_8pins1_dTP_R6#1.2)
Net8pins1_U3_5: U_ALL_channels/8pins1 (8pins1_U3.5), U_ALL_channels/8pins1/dTP (U_ALL_channels_8pins1_dTP_IC1#2.7 U_ALL_channels_8pins1_dTP_R6#2.2)
Net8pins1_U3_12: U_ALL_channels/8pins1 (8pins1_U3.12), U_ALL_channels/8pins1/dTP (U_ALL_channels_8pins1_dTP_IC1#3.7 U_ALL_channels_8pins1_dTP_R6#3.2)
Net8pins1_U3_13: U_ALL_channels/8pins1 (8pins1_U3.13), U_ALL_channels/8pins1/dTP (U_ALL_channels_8pins1_dTP_IC1#4.1 U_ALL_channels_8pins1_dTP_R5#4.2)
Net8pins1_U3_14: U_ALL_channels/8pins1 (8pins1_U3.14), U_ALL_channels/8pins1/dTP (U_ALL_channels_8pins1_dTP_IC1#4.7 U_ALL_channels_8pins1_dTP_R6#4.2)
Net8pins1_U3_15: U_ALL_channels/8pins1 (8pins1_U3.15), U_ALL_channels/8pins1/dTP (U_ALL_channels_8pins1_dTP_IC1#3.1 U_ALL_channels_8pins1_dTP_R5#3.2)
Net8pins1_U4_1: U_ALL_channels/8pins1 (8pins1_U4.1), U_ALL_channels/8pins1/dTP (U_ALL_channels_8pins1_dTP_Q1#4.1)
Net8pins1_U4_2: U_ALL_channels/8pins1 (8pins1_U4.2), U_ALL_channels/8pins1/dTP (U_ALL_channels_8pins1_dTP_Q2#3.1)
Net8pins1_U4_3: U_ALL_channels/8pins1 (8pins1_U4.3), U_ALL_channels/8pins1/dTP (U_ALL_channels_8pins1_dTP_Q1#3.1)
Net8pins1_U4_4: U_ALL_channels/8pins1 (8pins1_U4.4), U_ALL_channels/8pins1/dTP (U_ALL_channels_8pins1_dTP_Q2#2.1)
Net8pins1_U4_5: U_ALL_channels/8pins1 (8pins1_U4.5), U_ALL_channels/8pins1/dTP (U_ALL_channels_8pins1_dTP_Q1#2.1)
Net8pins1_U4_6: U_ALL_channels/8pins1 (8pins1_U4.6), U_ALL_channels/8pins1/dTP (U_ALL_channels_8pins1_dTP_Q2#1.1)
Net8pins1_U4_7: U_ALL_channels/8pins1 (8pins1_U4.7), U_ALL_channels/8pins1/dTP (U_ALL_channels_8pins1_dTP_Q1#1.1)
Net8pins1_U4_9: U_ALL_channels/8pins1 (8pins1_U4.9), U_ALL_channels/8pins2 (8pins2_U4.14)
Net8pins1_U4_15: U_ALL_channels/8pins1 (8pins1_U4.15), U_ALL_channels/8pins1/dTP (U_ALL_channels_8pins1_dTP_Q2#4.1)
Net8pins2_U2_1: U_ALL_channels/8pins2 (8pins2_U2.1), U_ALL_channels/8pins2/dTP (U_ALL_channels_8pins2_dTP_Q4#4.1)
Net8pins2_U2_2: U_ALL_channels/8pins2 (8pins2_U2.2), U_ALL_channels/8pins2/dTP (U_ALL_channels_8pins2_dTP_Q3#3.1)
Net8pins2_U2_3: U_ALL_channels/8pins2 (8pins2_U2.3), U_ALL_channels/8pins2/dTP (U_ALL_channels_8pins2_dTP_Q4#3.1)
Net8pins2_U2_4: U_ALL_channels/8pins2 (8pins2_U2.4), U_ALL_channels/8pins2/dTP (U_ALL_channels_8pins2_dTP_Q3#2.1)
Net8pins2_U2_5: U_ALL_channels/8pins2 (8pins2_U2.5), U_ALL_channels/8pins2/dTP (U_ALL_channels_8pins2_dTP_Q4#2.1)
Net8pins2_U2_6: U_ALL_channels/8pins2 (8pins2_U2.6), U_ALL_channels/8pins2/dTP (U_ALL_channels_8pins2_dTP_Q3#1.1)
Net8pins2_U2_7: U_ALL_channels/8pins2 (8pins2_U2.7), U_ALL_channels/8pins2/dTP (U_ALL_channels_8pins2_dTP_Q4#1.1)
Net8pins2_U2_9: U_ALL_channels/8pins2 (8pins2_U2.9), U_ALL_channels/8pins3 (8pins3_U2.14)
Net8pins2_U2_15: U_ALL_channels/8pins2 (8pins2_U2.15), U_ALL_channels/8pins2/dTP (U_ALL_channels_8pins2_dTP_Q3#4.1)
Net8pins2_U3_1: U_ALL_channels/8pins2 (8pins2_U3.1), U_ALL_channels/8pins2/dTP (U_ALL_channels_8pins2_dTP_IC1#2.1 U_ALL_channels_8pins2_dTP_R5#2.2)
Net8pins2_U3_2: U_ALL_channels/8pins2 (8pins2_U3.2), U_ALL_channels/8pins2/dTP (U_ALL_channels_8pins2_dTP_IC1#1.1 U_ALL_channels_8pins2_dTP_R5#1.2)
Net8pins2_U3_4: U_ALL_channels/8pins2 (8pins2_U3.4), U_ALL_channels/8pins2/dTP (U_ALL_channels_8pins2_dTP_IC1#1.7 U_ALL_channels_8pins2_dTP_R6#1.2)
Net8pins2_U3_5: U_ALL_channels/8pins2 (8pins2_U3.5), U_ALL_channels/8pins2/dTP (U_ALL_channels_8pins2_dTP_IC1#2.7 U_ALL_channels_8pins2_dTP_R6#2.2)
Net8pins2_U3_12: U_ALL_channels/8pins2 (8pins2_U3.12), U_ALL_channels/8pins2/dTP (U_ALL_channels_8pins2_dTP_IC1#3.7 U_ALL_channels_8pins2_dTP_R6#3.2)
Net8pins2_U3_13: U_ALL_channels/8pins2 (8pins2_U3.13), U_ALL_channels/8pins2/dTP (U_ALL_channels_8pins2_dTP_IC1#4.1 U_ALL_channels_8pins2_dTP_R5#4.2)
Net8pins2_U3_14: U_ALL_channels/8pins2 (8pins2_U3.14), U_ALL_channels/8pins2/dTP (U_ALL_channels_8pins2_dTP_IC1#4.7 U_ALL_channels_8pins2_dTP_R6#4.2)
Net8pins2_U3_15: U_ALL_channels/8pins2 (8pins2_U3.15), U_ALL_channels/8pins2/dTP (U_ALL_channels_8pins2_dTP_IC1#3.1 U_ALL_channels_8pins2_dTP_R5#3.2)
Net8pins2_U4_1: U_ALL_channels/8pins2 (8pins2_U4.1), U_ALL_channels/8pins2/dTP (U_ALL_channels_8pins2_dTP_Q1#4.1)
Net8pins2_U4_2: U_ALL_channels/8pins2 (8pins2_U4.2), U_ALL_channels/8pins2/dTP (U_ALL_channels_8pins2_dTP_Q2#3.1)
Net8pins2_U4_3: U_ALL_channels/8pins2 (8pins2_U4.3), U_ALL_channels/8pins2/dTP (U_ALL_channels_8pins2_dTP_Q1#3.1)
Net8pins2_U4_4: U_ALL_channels/8pins2 (8pins2_U4.4), U_ALL_channels/8pins2/dTP (U_ALL_channels_8pins2_dTP_Q2#2.1)
Net8pins2_U4_5: U_ALL_channels/8pins2 (8pins2_U4.5), U_ALL_channels/8pins2/dTP (U_ALL_channels_8pins2_dTP_Q1#2.1)
Net8pins2_U4_6: U_ALL_channels/8pins2 (8pins2_U4.6), U_ALL_channels/8pins2/dTP (U_ALL_channels_8pins2_dTP_Q2#1.1)
Net8pins2_U4_7: U_ALL_channels/8pins2 (8pins2_U4.7), U_ALL_channels/8pins2/dTP (U_ALL_channels_8pins2_dTP_Q1#1.1)
Net8pins2_U4_9: U_ALL_channels/8pins2 (8pins2_U4.9), U_ALL_channels/8pins3 (8pins3_U4.14)
Net8pins2_U4_15: U_ALL_channels/8pins2 (8pins2_U4.15), U_ALL_channels/8pins2/dTP (U_ALL_channels_8pins2_dTP_Q2#4.1)
Net8pins3_U2_1: U_ALL_channels/8pins3 (8pins3_U2.1), U_ALL_channels/8pins3/dTP (U_ALL_channels_8pins3_dTP_Q4#4.1)
Net8pins3_U2_2: U_ALL_channels/8pins3 (8pins3_U2.2), U_ALL_channels/8pins3/dTP (U_ALL_channels_8pins3_dTP_Q3#3.1)
Net8pins3_U2_3: U_ALL_channels/8pins3 (8pins3_U2.3), U_ALL_channels/8pins3/dTP (U_ALL_channels_8pins3_dTP_Q4#3.1)
Net8pins3_U2_4: U_ALL_channels/8pins3 (8pins3_U2.4), U_ALL_channels/8pins3/dTP (U_ALL_channels_8pins3_dTP_Q3#2.1)
Net8pins3_U2_5: U_ALL_channels/8pins3 (8pins3_U2.5), U_ALL_channels/8pins3/dTP (U_ALL_channels_8pins3_dTP_Q4#2.1)
Net8pins3_U2_6: U_ALL_channels/8pins3 (8pins3_U2.6), U_ALL_channels/8pins3/dTP (U_ALL_channels_8pins3_dTP_Q3#1.1)
Net8pins3_U2_7: U_ALL_channels/8pins3 (8pins3_U2.7), U_ALL_channels/8pins3/dTP (U_ALL_channels_8pins3_dTP_Q4#1.1)
Net8pins3_U2_9: U_ALL_channels/8pins3 (8pins3_U2.9), U_ALL_channels/8pins4 (8pins4_U2.14)
Net8pins3_U2_15: U_ALL_channels/8pins3 (8pins3_U2.15), U_ALL_channels/8pins3/dTP (U_ALL_channels_8pins3_dTP_Q3#4.1)
Net8pins3_U3_1: U_ALL_channels/8pins3 (8pins3_U3.1), U_ALL_channels/8pins3/dTP (U_ALL_channels_8pins3_dTP_IC1#2.1 U_ALL_channels_8pins3_dTP_R5#2.2)
Net8pins3_U3_2: U_ALL_channels/8pins3 (8pins3_U3.2), U_ALL_channels/8pins3/dTP (U_ALL_channels_8pins3_dTP_IC1#1.1 U_ALL_channels_8pins3_dTP_R5#1.2)
Net8pins3_U3_4: U_ALL_channels/8pins3 (8pins3_U3.4), U_ALL_channels/8pins3/dTP (U_ALL_channels_8pins3_dTP_IC1#1.7 U_ALL_channels_8pins3_dTP_R6#1.2)
Net8pins3_U3_5: U_ALL_channels/8pins3 (8pins3_U3.5), U_ALL_channels/8pins3/dTP (U_ALL_channels_8pins3_dTP_IC1#2.7 U_ALL_channels_8pins3_dTP_R6#2.2)
Net8pins3_U3_12: U_ALL_channels/8pins3 (8pins3_U3.12), U_ALL_channels/8pins3/dTP (U_ALL_channels_8pins3_dTP_IC1#3.7 U_ALL_channels_8pins3_dTP_R6#3.2)
Net8pins3_U3_13: U_ALL_channels/8pins3 (8pins3_U3.13), U_ALL_channels/8pins3/dTP (U_ALL_channels_8pins3_dTP_IC1#4.1 U_ALL_channels_8pins3_dTP_R5#4.2)
Net8pins3_U3_14: U_ALL_channels/8pins3 (8pins3_U3.14), U_ALL_channels/8pins3/dTP (U_ALL_channels_8pins3_dTP_IC1#4.7 U_ALL_channels_8pins3_dTP_R6#4.2)
Net8pins3_U3_15: U_ALL_channels/8pins3 (8pins3_U3.15), U_ALL_channels/8pins3/dTP (U_ALL_channels_8pins3_dTP_IC1#3.1 U_ALL_channels_8pins3_dTP_R5#3.2)
Net8pins3_U4_1: U_ALL_channels/8pins3 (8pins3_U4.1), U_ALL_channels/8pins3/dTP (U_ALL_channels_8pins3_dTP_Q1#4.1)
Net8pins3_U4_2: U_ALL_channels/8pins3 (8pins3_U4.2), U_ALL_channels/8pins3/dTP (U_ALL_channels_8pins3_dTP_Q2#3.1)
Net8pins3_U4_3: U_ALL_channels/8pins3 (8pins3_U4.3), U_ALL_channels/8pins3/dTP (U_ALL_channels_8pins3_dTP_Q1#3.1)
Net8pins3_U4_4: U_ALL_channels/8pins3 (8pins3_U4.4), U_ALL_channels/8pins3/dTP (U_ALL_channels_8pins3_dTP_Q2#2.1)
Net8pins3_U4_5: U_ALL_channels/8pins3 (8pins3_U4.5), U_ALL_channels/8pins3/dTP (U_ALL_channels_8pins3_dTP_Q1#2.1)
Net8pins3_U4_6: U_ALL_channels/8pins3 (8pins3_U4.6), U_ALL_channels/8pins3/dTP (U_ALL_channels_8pins3_dTP_Q2#1.1)
Net8pins3_U4_7: U_ALL_channels/8pins3 (8pins3_U4.7), U_ALL_channels/8pins3/dTP (U_ALL_channels_8pins3_dTP_Q1#1.1)
Net8pins3_U4_9: U_ALL_channels/8pins3 (8pins3_U4.9), U_ALL_channels/8pins4 (8pins4_U4.14)
Net8pins3_U4_15: U_ALL_channels/8pins3 (8pins3_U4.15), U_ALL_channels/8pins3/dTP (U_ALL_channels_8pins3_dTP_Q2#4.1)
Net8pins4_U2_1: U_ALL_channels/8pins4 (8pins4_U2.1), U_ALL_channels/8pins4/dTP (U_ALL_channels_8pins4_dTP_Q4#4.1)
Net8pins4_U2_2: U_ALL_channels/8pins4 (8pins4_U2.2), U_ALL_channels/8pins4/dTP (U_ALL_channels_8pins4_dTP_Q3#3.1)
Net8pins4_U2_3: U_ALL_channels/8pins4 (8pins4_U2.3), U_ALL_channels/8pins4/dTP (U_ALL_channels_8pins4_dTP_Q4#3.1)
Net8pins4_U2_4: U_ALL_channels/8pins4 (8pins4_U2.4), U_ALL_channels/8pins4/dTP (U_ALL_channels_8pins4_dTP_Q3#2.1)
Net8pins4_U2_5: U_ALL_channels/8pins4 (8pins4_U2.5), U_ALL_channels/8pins4/dTP (U_ALL_channels_8pins4_dTP_Q4#2.1)
Net8pins4_U2_6: U_ALL_channels/8pins4 (8pins4_U2.6), U_ALL_channels/8pins4/dTP (U_ALL_channels_8pins4_dTP_Q3#1.1)
Net8pins4_U2_7: U_ALL_channels/8pins4 (8pins4_U2.7), U_ALL_channels/8pins4/dTP (U_ALL_channels_8pins4_dTP_Q4#1.1)
Net8pins4_U2_9: U_ALL_channels/8pins4 (8pins4_U2.9), U_ALL_channels/8pins5 (8pins5_U2.14)
Net8pins4_U2_15: U_ALL_channels/8pins4 (8pins4_U2.15), U_ALL_channels/8pins4/dTP (U_ALL_channels_8pins4_dTP_Q3#4.1)
Net8pins4_U3_1: U_ALL_channels/8pins4 (8pins4_U3.1), U_ALL_channels/8pins4/dTP (U_ALL_channels_8pins4_dTP_IC1#2.1 U_ALL_channels_8pins4_dTP_R5#2.2)
Net8pins4_U3_2: U_ALL_channels/8pins4 (8pins4_U3.2), U_ALL_channels/8pins4/dTP (U_ALL_channels_8pins4_dTP_IC1#1.1 U_ALL_channels_8pins4_dTP_R5#1.2)
Net8pins4_U3_4: U_ALL_channels/8pins4 (8pins4_U3.4), U_ALL_channels/8pins4/dTP (U_ALL_channels_8pins4_dTP_IC1#1.7 U_ALL_channels_8pins4_dTP_R6#1.2)
Net8pins4_U3_5: U_ALL_channels/8pins4 (8pins4_U3.5), U_ALL_channels/8pins4/dTP (U_ALL_channels_8pins4_dTP_IC1#2.7 U_ALL_channels_8pins4_dTP_R6#2.2)
Net8pins4_U3_12: U_ALL_channels/8pins4 (8pins4_U3.12), U_ALL_channels/8pins4/dTP (U_ALL_channels_8pins4_dTP_IC1#3.7 U_ALL_channels_8pins4_dTP_R6#3.2)
Net8pins4_U3_13: U_ALL_channels/8pins4 (8pins4_U3.13), U_ALL_channels/8pins4/dTP (U_ALL_channels_8pins4_dTP_IC1#4.1 U_ALL_channels_8pins4_dTP_R5#4.2)
Net8pins4_U3_14: U_ALL_channels/8pins4 (8pins4_U3.14), U_ALL_channels/8pins4/dTP (U_ALL_channels_8pins4_dTP_IC1#4.7 U_ALL_channels_8pins4_dTP_R6#4.2)
Net8pins4_U3_15: U_ALL_channels/8pins4 (8pins4_U3.15), U_ALL_channels/8pins4/dTP (U_ALL_channels_8pins4_dTP_IC1#3.1 U_ALL_channels_8pins4_dTP_R5#3.2)
Net8pins4_U4_1: U_ALL_channels/8pins4 (8pins4_U4.1), U_ALL_channels/8pins4/dTP (U_ALL_channels_8pins4_dTP_Q1#4.1)
Net8pins4_U4_2: U_ALL_channels/8pins4 (8pins4_U4.2), U_ALL_channels/8pins4/dTP (U_ALL_channels_8pins4_dTP_Q2#3.1)
Net8pins4_U4_3: U_ALL_channels/8pins4 (8pins4_U4.3), U_ALL_channels/8pins4/dTP (U_ALL_channels_8pins4_dTP_Q1#3.1)
Net8pins4_U4_4: U_ALL_channels/8pins4 (8pins4_U4.4), U_ALL_channels/8pins4/dTP (U_ALL_channels_8pins4_dTP_Q2#2.1)
Net8pins4_U4_5: U_ALL_channels/8pins4 (8pins4_U4.5), U_ALL_channels/8pins4/dTP (U_ALL_channels_8pins4_dTP_Q1#2.1)
Net8pins4_U4_6: U_ALL_channels/8pins4 (8pins4_U4.6), U_ALL_channels/8pins4/dTP (U_ALL_channels_8pins4_dTP_Q2#1.1)
Net8pins4_U4_7: U_ALL_channels/8pins4 (8pins4_U4.7), U_ALL_channels/8pins4/dTP (U_ALL_channels_8pins4_dTP_Q1#1.1)
Net8pins4_U4_9: U_ALL_channels/8pins4 (8pins4_U4.9), U_ALL_channels/8pins5 (8pins5_U4.14)
Net8pins4_U4_15: U_ALL_channels/8pins4 (8pins4_U4.15), U_ALL_channels/8pins4/dTP (U_ALL_channels_8pins4_dTP_Q2#4.1)
Net8pins5_U2_1: U_ALL_channels/8pins5 (8pins5_U2.1), U_ALL_channels/8pins5/dTP (U_ALL_channels_8pins5_dTP_Q4#4.1)
Net8pins5_U2_2: U_ALL_channels/8pins5 (8pins5_U2.2), U_ALL_channels/8pins5/dTP (U_ALL_channels_8pins5_dTP_Q3#3.1)
Net8pins5_U2_3: U_ALL_channels/8pins5 (8pins5_U2.3), U_ALL_channels/8pins5/dTP (U_ALL_channels_8pins5_dTP_Q4#3.1)
Net8pins5_U2_4: U_ALL_channels/8pins5 (8pins5_U2.4), U_ALL_channels/8pins5/dTP (U_ALL_channels_8pins5_dTP_Q3#2.1)
Net8pins5_U2_5: U_ALL_channels/8pins5 (8pins5_U2.5), U_ALL_channels/8pins5/dTP (U_ALL_channels_8pins5_dTP_Q4#2.1)
Net8pins5_U2_6: U_ALL_channels/8pins5 (8pins5_U2.6), U_ALL_channels/8pins5/dTP (U_ALL_channels_8pins5_dTP_Q3#1.1)
Net8pins5_U2_7: U_ALL_channels/8pins5 (8pins5_U2.7), U_ALL_channels/8pins5/dTP (U_ALL_channels_8pins5_dTP_Q4#1.1)
Net8pins5_U2_15: U_ALL_channels/8pins5 (8pins5_U2.15), U_ALL_channels/8pins5/dTP (U_ALL_channels_8pins5_dTP_Q3#4.1)
Net8pins5_U3_1: U_ALL_channels/8pins5 (8pins5_U3.1), U_ALL_channels/8pins5/dTP (U_ALL_channels_8pins5_dTP_IC1#2.1 U_ALL_channels_8pins5_dTP_R5#2.2)
Net8pins5_U3_2: U_ALL_channels/8pins5 (8pins5_U3.2), U_ALL_channels/8pins5/dTP (U_ALL_channels_8pins5_dTP_IC1#1.1 U_ALL_channels_8pins5_dTP_R5#1.2)
Net8pins5_U3_4: U_ALL_channels/8pins5 (8pins5_U3.4), U_ALL_channels/8pins5/dTP (U_ALL_channels_8pins5_dTP_IC1#1.7 U_ALL_channels_8pins5_dTP_R6#1.2)
Net8pins5_U3_5: U_ALL_channels/8pins5 (8pins5_U3.5), U_ALL_channels/8pins5/dTP (U_ALL_channels_8pins5_dTP_IC1#2.7 U_ALL_channels_8pins5_dTP_R6#2.2)
Net8pins5_U3_12: U_ALL_channels/8pins5 (8pins5_U3.12), U_ALL_channels/8pins5/dTP (U_ALL_channels_8pins5_dTP_IC1#3.7 U_ALL_channels_8pins5_dTP_R6#3.2)
Net8pins5_U3_13: U_ALL_channels/8pins5 (8pins5_U3.13), U_ALL_channels/8pins5/dTP (U_ALL_channels_8pins5_dTP_IC1#4.1 U_ALL_channels_8pins5_dTP_R5#4.2)
Net8pins5_U3_14: U_ALL_channels/8pins5 (8pins5_U3.14), U_ALL_channels/8pins5/dTP (U_ALL_channels_8pins5_dTP_IC1#4.7 U_ALL_channels_8pins5_dTP_R6#4.2)
Net8pins5_U3_15: U_ALL_channels/8pins5 (8pins5_U3.15), U_ALL_channels/8pins5/dTP (U_ALL_channels_8pins5_dTP_IC1#3.1 U_ALL_channels_8pins5_dTP_R5#3.2)
Net8pins5_U4_1: U_ALL_channels/8pins5 (8pins5_U4.1), U_ALL_channels/8pins5/dTP (U_ALL_channels_8pins5_dTP_Q1#4.1)
Net8pins5_U4_2: U_ALL_channels/8pins5 (8pins5_U4.2), U_ALL_channels/8pins5/dTP (U_ALL_channels_8pins5_dTP_Q2#3.1)
Net8pins5_U4_3: U_ALL_channels/8pins5 (8pins5_U4.3), U_ALL_channels/8pins5/dTP (U_ALL_channels_8pins5_dTP_Q1#3.1)
Net8pins5_U4_4: U_ALL_channels/8pins5 (8pins5_U4.4), U_ALL_channels/8pins5/dTP (U_ALL_channels_8pins5_dTP_Q2#2.1)
Net8pins5_U4_5: U_ALL_channels/8pins5 (8pins5_U4.5), U_ALL_channels/8pins5/dTP (U_ALL_channels_8pins5_dTP_Q1#2.1)
Net8pins5_U4_6: U_ALL_channels/8pins5 (8pins5_U4.6), U_ALL_channels/8pins5/dTP (U_ALL_channels_8pins5_dTP_Q2#1.1)
Net8pins5_U4_7: U_ALL_channels/8pins5 (8pins5_U4.7), U_ALL_channels/8pins5/dTP (U_ALL_channels_8pins5_dTP_Q1#1.1)
Net8pins5_U4_15: U_ALL_channels/8pins5 (8pins5_U4.15), U_ALL_channels/8pins5/dTP (U_ALL_channels_8pins5_dTP_Q2#4.1)
Net8pins6_U2_1: U_ALL_channels/8pins6 (8pins6_U2.1), U_ALL_channels/8pins6/dTP (U_ALL_channels_8pins6_dTP_Q4#4.1)
Net8pins6_U2_2: U_ALL_channels/8pins6 (8pins6_U2.2), U_ALL_channels/8pins6/dTP (U_ALL_channels_8pins6_dTP_Q3#3.1)
Net8pins6_U2_3: U_ALL_channels/8pins6 (8pins6_U2.3), U_ALL_channels/8pins6/dTP (U_ALL_channels_8pins6_dTP_Q4#3.1)
Net8pins6_U2_4: U_ALL_channels/8pins6 (8pins6_U2.4), U_ALL_channels/8pins6/dTP (U_ALL_channels_8pins6_dTP_Q3#2.1)
Net8pins6_U2_5: U_ALL_channels/8pins6 (8pins6_U2.5), U_ALL_channels/8pins6/dTP (U_ALL_channels_8pins6_dTP_Q4#2.1)
Net8pins6_U2_6: U_ALL_channels/8pins6 (8pins6_U2.6), U_ALL_channels/8pins6/dTP (U_ALL_channels_8pins6_dTP_Q3#1.1)
Net8pins6_U2_7: U_ALL_channels/8pins6 (8pins6_U2.7), U_ALL_channels/8pins6/dTP (U_ALL_channels_8pins6_dTP_Q4#1.1)
Net8pins6_U2_9: U_ALL_channels/8pins6 (8pins6_U2.9), U_ALL_channels/8pins7 (8pins7_U2.14)
Net8pins6_U2_15: U_ALL_channels/8pins6 (8pins6_U2.15), U_ALL_channels/8pins6/dTP (U_ALL_channels_8pins6_dTP_Q3#4.1)
Net8pins6_U3_1: U_ALL_channels/8pins6 (8pins6_U3.1), U_ALL_channels/8pins6/dTP (U_ALL_channels_8pins6_dTP_IC1#2.1 U_ALL_channels_8pins6_dTP_R5#2.2)
Net8pins6_U3_2: U_ALL_channels/8pins6 (8pins6_U3.2), U_ALL_channels/8pins6/dTP (U_ALL_channels_8pins6_dTP_IC1#1.1 U_ALL_channels_8pins6_dTP_R5#1.2)
Net8pins6_U3_4: U_ALL_channels/8pins6 (8pins6_U3.4), U_ALL_channels/8pins6/dTP (U_ALL_channels_8pins6_dTP_IC1#1.7 U_ALL_channels_8pins6_dTP_R6#1.2)
Net8pins6_U3_5: U_ALL_channels/8pins6 (8pins6_U3.5), U_ALL_channels/8pins6/dTP (U_ALL_channels_8pins6_dTP_IC1#2.7 U_ALL_channels_8pins6_dTP_R6#2.2)
Net8pins6_U3_12: U_ALL_channels/8pins6 (8pins6_U3.12), U_ALL_channels/8pins6/dTP (U_ALL_channels_8pins6_dTP_IC1#3.7 U_ALL_channels_8pins6_dTP_R6#3.2)
Net8pins6_U3_13: U_ALL_channels/8pins6 (8pins6_U3.13), U_ALL_channels/8pins6/dTP (U_ALL_channels_8pins6_dTP_IC1#4.1 U_ALL_channels_8pins6_dTP_R5#4.2)
Net8pins6_U3_14: U_ALL_channels/8pins6 (8pins6_U3.14), U_ALL_channels/8pins6/dTP (U_ALL_channels_8pins6_dTP_IC1#4.7 U_ALL_channels_8pins6_dTP_R6#4.2)
Net8pins6_U3_15: U_ALL_channels/8pins6 (8pins6_U3.15), U_ALL_channels/8pins6/dTP (U_ALL_channels_8pins6_dTP_IC1#3.1 U_ALL_channels_8pins6_dTP_R5#3.2)
Net8pins6_U4_1: U_ALL_channels/8pins6 (8pins6_U4.1), U_ALL_channels/8pins6/dTP (U_ALL_channels_8pins6_dTP_Q1#4.1)
Net8pins6_U4_2: U_ALL_channels/8pins6 (8pins6_U4.2), U_ALL_channels/8pins6/dTP (U_ALL_channels_8pins6_dTP_Q2#3.1)
Net8pins6_U4_3: U_ALL_channels/8pins6 (8pins6_U4.3), U_ALL_channels/8pins6/dTP (U_ALL_channels_8pins6_dTP_Q1#3.1)
Net8pins6_U4_4: U_ALL_channels/8pins6 (8pins6_U4.4), U_ALL_channels/8pins6/dTP (U_ALL_channels_8pins6_dTP_Q2#2.1)
Net8pins6_U4_5: U_ALL_channels/8pins6 (8pins6_U4.5), U_ALL_channels/8pins6/dTP (U_ALL_channels_8pins6_dTP_Q1#2.1)
Net8pins6_U4_6: U_ALL_channels/8pins6 (8pins6_U4.6), U_ALL_channels/8pins6/dTP (U_ALL_channels_8pins6_dTP_Q2#1.1)
Net8pins6_U4_7: U_ALL_channels/8pins6 (8pins6_U4.7), U_ALL_channels/8pins6/dTP (U_ALL_channels_8pins6_dTP_Q1#1.1)
Net8pins6_U4_9: U_ALL_channels/8pins6 (8pins6_U4.9), U_ALL_channels/8pins7 (8pins7_U4.14)
Net8pins6_U4_15: U_ALL_channels/8pins6 (8pins6_U4.15), U_ALL_channels/8pins6/dTP (U_ALL_channels_8pins6_dTP_Q2#4.1)
Net8pins7_U2_1: U_ALL_channels/8pins7 (8pins7_U2.1), U_ALL_channels/8pins7/dTP (U_ALL_channels_8pins7_dTP_Q4#4.1)
Net8pins7_U2_2: U_ALL_channels/8pins7 (8pins7_U2.2), U_ALL_channels/8pins7/dTP (U_ALL_channels_8pins7_dTP_Q3#3.1)
Net8pins7_U2_3: U_ALL_channels/8pins7 (8pins7_U2.3), U_ALL_channels/8pins7/dTP (U_ALL_channels_8pins7_dTP_Q4#3.1)
Net8pins7_U2_4: U_ALL_channels/8pins7 (8pins7_U2.4), U_ALL_channels/8pins7/dTP (U_ALL_channels_8pins7_dTP_Q3#2.1)
Net8pins7_U2_5: U_ALL_channels/8pins7 (8pins7_U2.5), U_ALL_channels/8pins7/dTP (U_ALL_channels_8pins7_dTP_Q4#2.1)
Net8pins7_U2_6: U_ALL_channels/8pins7 (8pins7_U2.6), U_ALL_channels/8pins7/dTP (U_ALL_channels_8pins7_dTP_Q3#1.1)
Net8pins7_U2_7: U_ALL_channels/8pins7 (8pins7_U2.7), U_ALL_channels/8pins7/dTP (U_ALL_channels_8pins7_dTP_Q4#1.1)
Net8pins7_U2_9: U_ALL_channels/8pins7 (8pins7_U2.9), U_ALL_channels/8pins8 (8pins8_U2.14)
Net8pins7_U2_15: U_ALL_channels/8pins7 (8pins7_U2.15), U_ALL_channels/8pins7/dTP (U_ALL_channels_8pins7_dTP_Q3#4.1)
Net8pins7_U3_1: U_ALL_channels/8pins7 (8pins7_U3.1), U_ALL_channels/8pins7/dTP (U_ALL_channels_8pins7_dTP_IC1#2.1 U_ALL_channels_8pins7_dTP_R5#2.2)
Net8pins7_U3_2: U_ALL_channels/8pins7 (8pins7_U3.2), U_ALL_channels/8pins7/dTP (U_ALL_channels_8pins7_dTP_IC1#1.1 U_ALL_channels_8pins7_dTP_R5#1.2)
Net8pins7_U3_4: U_ALL_channels/8pins7 (8pins7_U3.4), U_ALL_channels/8pins7/dTP (U_ALL_channels_8pins7_dTP_IC1#1.7 U_ALL_channels_8pins7_dTP_R6#1.2)
Net8pins7_U3_5: U_ALL_channels/8pins7 (8pins7_U3.5), U_ALL_channels/8pins7/dTP (U_ALL_channels_8pins7_dTP_IC1#2.7 U_ALL_channels_8pins7_dTP_R6#2.2)
Net8pins7_U3_12: U_ALL_channels/8pins7 (8pins7_U3.12), U_ALL_channels/8pins7/dTP (U_ALL_channels_8pins7_dTP_IC1#3.7 U_ALL_channels_8pins7_dTP_R6#3.2)
Net8pins7_U3_13: U_ALL_channels/8pins7 (8pins7_U3.13), U_ALL_channels/8pins7/dTP (U_ALL_channels_8pins7_dTP_IC1#4.1 U_ALL_channels_8pins7_dTP_R5#4.2)
Net8pins7_U3_14: U_ALL_channels/8pins7 (8pins7_U3.14), U_ALL_channels/8pins7/dTP (U_ALL_channels_8pins7_dTP_IC1#4.7 U_ALL_channels_8pins7_dTP_R6#4.2)
Net8pins7_U3_15: U_ALL_channels/8pins7 (8pins7_U3.15), U_ALL_channels/8pins7/dTP (U_ALL_channels_8pins7_dTP_IC1#3.1 U_ALL_channels_8pins7_dTP_R5#3.2)
Net8pins7_U4_1: U_ALL_channels/8pins7 (8pins7_U4.1), U_ALL_channels/8pins7/dTP (U_ALL_channels_8pins7_dTP_Q1#4.1)
Net8pins7_U4_2: U_ALL_channels/8pins7 (8pins7_U4.2), U_ALL_channels/8pins7/dTP (U_ALL_channels_8pins7_dTP_Q2#3.1)
Net8pins7_U4_3: U_ALL_channels/8pins7 (8pins7_U4.3), U_ALL_channels/8pins7/dTP (U_ALL_channels_8pins7_dTP_Q1#3.1)
Net8pins7_U4_4: U_ALL_channels/8pins7 (8pins7_U4.4), U_ALL_channels/8pins7/dTP (U_ALL_channels_8pins7_dTP_Q2#2.1)
Net8pins7_U4_5: U_ALL_channels/8pins7 (8pins7_U4.5), U_ALL_channels/8pins7/dTP (U_ALL_channels_8pins7_dTP_Q1#2.1)
Net8pins7_U4_6: U_ALL_channels/8pins7 (8pins7_U4.6), U_ALL_channels/8pins7/dTP (U_ALL_channels_8pins7_dTP_Q2#1.1)
Net8pins7_U4_7: U_ALL_channels/8pins7 (8pins7_U4.7), U_ALL_channels/8pins7/dTP (U_ALL_channels_8pins7_dTP_Q1#1.1)
Net8pins7_U4_9: U_ALL_channels/8pins7 (8pins7_U4.9), U_ALL_channels/8pins8 (8pins8_U4.14)
Net8pins7_U4_15: U_ALL_channels/8pins7 (8pins7_U4.15), U_ALL_channels/8pins7/dTP (U_ALL_channels_8pins7_dTP_Q2#4.1)
Net8pins8_U2_1: U_ALL_channels/8pins8 (8pins8_U2.1), U_ALL_channels/8pins8/dTP (U_ALL_channels_8pins8_dTP_Q4#4.1)
Net8pins8_U2_2: U_ALL_channels/8pins8 (8pins8_U2.2), U_ALL_channels/8pins8/dTP (U_ALL_channels_8pins8_dTP_Q3#3.1)
Net8pins8_U2_3: U_ALL_channels/8pins8 (8pins8_U2.3), U_ALL_channels/8pins8/dTP (U_ALL_channels_8pins8_dTP_Q4#3.1)
Net8pins8_U2_4: U_ALL_channels/8pins8 (8pins8_U2.4), U_ALL_channels/8pins8/dTP (U_ALL_channels_8pins8_dTP_Q3#2.1)
Net8pins8_U2_5: U_ALL_channels/8pins8 (8pins8_U2.5), U_ALL_channels/8pins8/dTP (U_ALL_channels_8pins8_dTP_Q4#2.1)
Net8pins8_U2_6: U_ALL_channels/8pins8 (8pins8_U2.6), U_ALL_channels/8pins8/dTP (U_ALL_channels_8pins8_dTP_Q3#1.1)
Net8pins8_U2_7: U_ALL_channels/8pins8 (8pins8_U2.7), U_ALL_channels/8pins8/dTP (U_ALL_channels_8pins8_dTP_Q4#1.1)
Net8pins8_U2_9: U_ALL_channels/8pins8 (8pins8_U2.9), U_ALL_channels/8pins9 (8pins9_U2.14)
Net8pins8_U2_15: U_ALL_channels/8pins8 (8pins8_U2.15), U_ALL_channels/8pins8/dTP (U_ALL_channels_8pins8_dTP_Q3#4.1)
Net8pins8_U3_1: U_ALL_channels/8pins8 (8pins8_U3.1), U_ALL_channels/8pins8/dTP (U_ALL_channels_8pins8_dTP_IC1#2.1 U_ALL_channels_8pins8_dTP_R5#2.2)
Net8pins8_U3_2: U_ALL_channels/8pins8 (8pins8_U3.2), U_ALL_channels/8pins8/dTP (U_ALL_channels_8pins8_dTP_IC1#1.1 U_ALL_channels_8pins8_dTP_R5#1.2)
Net8pins8_U3_4: U_ALL_channels/8pins8 (8pins8_U3.4), U_ALL_channels/8pins8/dTP (U_ALL_channels_8pins8_dTP_IC1#1.7 U_ALL_channels_8pins8_dTP_R6#1.2)
Net8pins8_U3_5: U_ALL_channels/8pins8 (8pins8_U3.5), U_ALL_channels/8pins8/dTP (U_ALL_channels_8pins8_dTP_IC1#2.7 U_ALL_channels_8pins8_dTP_R6#2.2)
Net8pins8_U3_12: U_ALL_channels/8pins8 (8pins8_U3.12), U_ALL_channels/8pins8/dTP (U_ALL_channels_8pins8_dTP_IC1#3.7 U_ALL_channels_8pins8_dTP_R6#3.2)
Net8pins8_U3_13: U_ALL_channels/8pins8 (8pins8_U3.13), U_ALL_channels/8pins8/dTP (U_ALL_channels_8pins8_dTP_IC1#4.1 U_ALL_channels_8pins8_dTP_R5#4.2)
Net8pins8_U3_14: U_ALL_channels/8pins8 (8pins8_U3.14), U_ALL_channels/8pins8/dTP (U_ALL_channels_8pins8_dTP_IC1#4.7 U_ALL_channels_8pins8_dTP_R6#4.2)
Net8pins8_U3_15: U_ALL_channels/8pins8 (8pins8_U3.15), U_ALL_channels/8pins8/dTP (U_ALL_channels_8pins8_dTP_IC1#3.1 U_ALL_channels_8pins8_dTP_R5#3.2)
Net8pins8_U4_1: U_ALL_channels/8pins8 (8pins8_U4.1), U_ALL_channels/8pins8/dTP (U_ALL_channels_8pins8_dTP_Q1#4.1)
Net8pins8_U4_2: U_ALL_channels/8pins8 (8pins8_U4.2), U_ALL_channels/8pins8/dTP (U_ALL_channels_8pins8_dTP_Q2#3.1)
Net8pins8_U4_3: U_ALL_channels/8pins8 (8pins8_U4.3), U_ALL_channels/8pins8/dTP (U_ALL_channels_8pins8_dTP_Q1#3.1)
Net8pins8_U4_4: U_ALL_channels/8pins8 (8pins8_U4.4), U_ALL_channels/8pins8/dTP (U_ALL_channels_8pins8_dTP_Q2#2.1)
Net8pins8_U4_5: U_ALL_channels/8pins8 (8pins8_U4.5), U_ALL_channels/8pins8/dTP (U_ALL_channels_8pins8_dTP_Q1#2.1)
Net8pins8_U4_6: U_ALL_channels/8pins8 (8pins8_U4.6), U_ALL_channels/8pins8/dTP (U_ALL_channels_8pins8_dTP_Q2#1.1)
Net8pins8_U4_7: U_ALL_channels/8pins8 (8pins8_U4.7), U_ALL_channels/8pins8/dTP (U_ALL_channels_8pins8_dTP_Q1#1.1)
Net8pins8_U4_9: U_ALL_channels/8pins8 (8pins8_U4.9), U_ALL_channels/8pins9 (8pins9_U4.14)
Net8pins8_U4_15: U_ALL_channels/8pins8 (8pins8_U4.15), U_ALL_channels/8pins8/dTP (U_ALL_channels_8pins8_dTP_Q2#4.1)
Net8pins9_U2_1: U_ALL_channels/8pins9 (8pins9_U2.1), U_ALL_channels/8pins9/dTP (U_ALL_channels_8pins9_dTP_Q4#4.1)
Net8pins9_U2_2: U_ALL_channels/8pins9 (8pins9_U2.2), U_ALL_channels/8pins9/dTP (U_ALL_channels_8pins9_dTP_Q3#3.1)
Net8pins9_U2_3: U_ALL_channels/8pins9 (8pins9_U2.3), U_ALL_channels/8pins9/dTP (U_ALL_channels_8pins9_dTP_Q4#3.1)
Net8pins9_U2_4: U_ALL_channels/8pins9 (8pins9_U2.4), U_ALL_channels/8pins9/dTP (U_ALL_channels_8pins9_dTP_Q3#2.1)
Net8pins9_U2_5: U_ALL_channels/8pins9 (8pins9_U2.5), U_ALL_channels/8pins9/dTP (U_ALL_channels_8pins9_dTP_Q4#2.1)
Net8pins9_U2_6: U_ALL_channels/8pins9 (8pins9_U2.6), U_ALL_channels/8pins9/dTP (U_ALL_channels_8pins9_dTP_Q3#1.1)
Net8pins9_U2_7: U_ALL_channels/8pins9 (8pins9_U2.7), U_ALL_channels/8pins9/dTP (U_ALL_channels_8pins9_dTP_Q4#1.1)
Net8pins9_U2_9: U_ALL_channels/8pins9 (8pins9_U2.9), U_ALL_channels/8pins10 (8pins10_U2.14)
Net8pins9_U2_15: U_ALL_channels/8pins9 (8pins9_U2.15), U_ALL_channels/8pins9/dTP (U_ALL_channels_8pins9_dTP_Q3#4.1)
Net8pins9_U3_1: U_ALL_channels/8pins9 (8pins9_U3.1), U_ALL_channels/8pins9/dTP (U_ALL_channels_8pins9_dTP_IC1#2.1 U_ALL_channels_8pins9_dTP_R5#2.2)
Net8pins9_U3_2: U_ALL_channels/8pins9 (8pins9_U3.2), U_ALL_channels/8pins9/dTP (U_ALL_channels_8pins9_dTP_IC1#1.1 U_ALL_channels_8pins9_dTP_R5#1.2)
Net8pins9_U3_4: U_ALL_channels/8pins9 (8pins9_U3.4), U_ALL_channels/8pins9/dTP (U_ALL_channels_8pins9_dTP_IC1#1.7 U_ALL_channels_8pins9_dTP_R6#1.2)
Net8pins9_U3_5: U_ALL_channels/8pins9 (8pins9_U3.5), U_ALL_channels/8pins9/dTP (U_ALL_channels_8pins9_dTP_IC1#2.7 U_ALL_channels_8pins9_dTP_R6#2.2)
Net8pins9_U3_12: U_ALL_channels/8pins9 (8pins9_U3.12), U_ALL_channels/8pins9/dTP (U_ALL_channels_8pins9_dTP_IC1#3.7 U_ALL_channels_8pins9_dTP_R6#3.2)
Net8pins9_U3_13: U_ALL_channels/8pins9 (8pins9_U3.13), U_ALL_channels/8pins9/dTP (U_ALL_channels_8pins9_dTP_IC1#4.1 U_ALL_channels_8pins9_dTP_R5#4.2)
Net8pins9_U3_14: U_ALL_channels/8pins9 (8pins9_U3.14), U_ALL_channels/8pins9/dTP (U_ALL_channels_8pins9_dTP_IC1#4.7 U_ALL_channels_8pins9_dTP_R6#4.2)
Net8pins9_U3_15: U_ALL_channels/8pins9 (8pins9_U3.15), U_ALL_channels/8pins9/dTP (U_ALL_channels_8pins9_dTP_IC1#3.1 U_ALL_channels_8pins9_dTP_R5#3.2)
Net8pins9_U4_1: U_ALL_channels/8pins9 (8pins9_U4.1), U_ALL_channels/8pins9/dTP (U_ALL_channels_8pins9_dTP_Q1#4.1)
Net8pins9_U4_2: U_ALL_channels/8pins9 (8pins9_U4.2), U_ALL_channels/8pins9/dTP (U_ALL_channels_8pins9_dTP_Q2#3.1)
Net8pins9_U4_3: U_ALL_channels/8pins9 (8pins9_U4.3), U_ALL_channels/8pins9/dTP (U_ALL_channels_8pins9_dTP_Q1#3.1)
Net8pins9_U4_4: U_ALL_channels/8pins9 (8pins9_U4.4), U_ALL_channels/8pins9/dTP (U_ALL_channels_8pins9_dTP_Q2#2.1)
Net8pins9_U4_5: U_ALL_channels/8pins9 (8pins9_U4.5), U_ALL_channels/8pins9/dTP (U_ALL_channels_8pins9_dTP_Q1#2.1)
Net8pins9_U4_6: U_ALL_channels/8pins9 (8pins9_U4.6), U_ALL_channels/8pins9/dTP (U_ALL_channels_8pins9_dTP_Q2#1.1)
Net8pins9_U4_7: U_ALL_channels/8pins9 (8pins9_U4.7), U_ALL_channels/8pins9/dTP (U_ALL_channels_8pins9_dTP_Q1#1.1)
Net8pins9_U4_9: U_ALL_channels/8pins9 (8pins9_U4.9), U_ALL_channels/8pins10 (8pins10_U4.14)
Net8pins9_U4_15: U_ALL_channels/8pins9 (8pins9_U4.15), U_ALL_channels/8pins9/dTP (U_ALL_channels_8pins9_dTP_Q2#4.1)
Net8pins10_U2_1: U_ALL_channels/8pins10 (8pins10_U2.1), U_ALL_channels/8pins10/dTP (U_ALL_channels_8pins10_dTP_Q4#4.1)
Net8pins10_U2_2: U_ALL_channels/8pins10 (8pins10_U2.2), U_ALL_channels/8pins10/dTP (U_ALL_channels_8pins10_dTP_Q3#3.1)
Net8pins10_U2_3: U_ALL_channels/8pins10 (8pins10_U2.3), U_ALL_channels/8pins10/dTP (U_ALL_channels_8pins10_dTP_Q4#3.1)
Net8pins10_U2_4: U_ALL_channels/8pins10 (8pins10_U2.4), U_ALL_channels/8pins10/dTP (U_ALL_channels_8pins10_dTP_Q3#2.1)
Net8pins10_U2_5: U_ALL_channels/8pins10 (8pins10_U2.5), U_ALL_channels/8pins10/dTP (U_ALL_channels_8pins10_dTP_Q4#2.1)
Net8pins10_U2_6: U_ALL_channels/8pins10 (8pins10_U2.6), U_ALL_channels/8pins10/dTP (U_ALL_channels_8pins10_dTP_Q3#1.1)
Net8pins10_U2_7: U_ALL_channels/8pins10 (8pins10_U2.7), U_ALL_channels/8pins10/dTP (U_ALL_channels_8pins10_dTP_Q4#1.1)
Net8pins10_U2_15: U_ALL_channels/8pins10 (8pins10_U2.15), U_ALL_channels/8pins10/dTP (U_ALL_channels_8pins10_dTP_Q3#4.1)
Net8pins10_U3_1: U_ALL_channels/8pins10 (8pins10_U3.1), U_ALL_channels/8pins10/dTP (U_ALL_channels_8pins10_dTP_IC1#2.1 U_ALL_channels_8pins10_dTP_R5#2.2)
Net8pins10_U3_2: U_ALL_channels/8pins10 (8pins10_U3.2), U_ALL_channels/8pins10/dTP (U_ALL_channels_8pins10_dTP_IC1#1.1 U_ALL_channels_8pins10_dTP_R5#1.2)
Net8pins10_U3_4: U_ALL_channels/8pins10 (8pins10_U3.4), U_ALL_channels/8pins10/dTP (U_ALL_channels_8pins10_dTP_IC1#1.7 U_ALL_channels_8pins10_dTP_R6#1.2)